# EAGLE board coke (EAGLE 5.06)
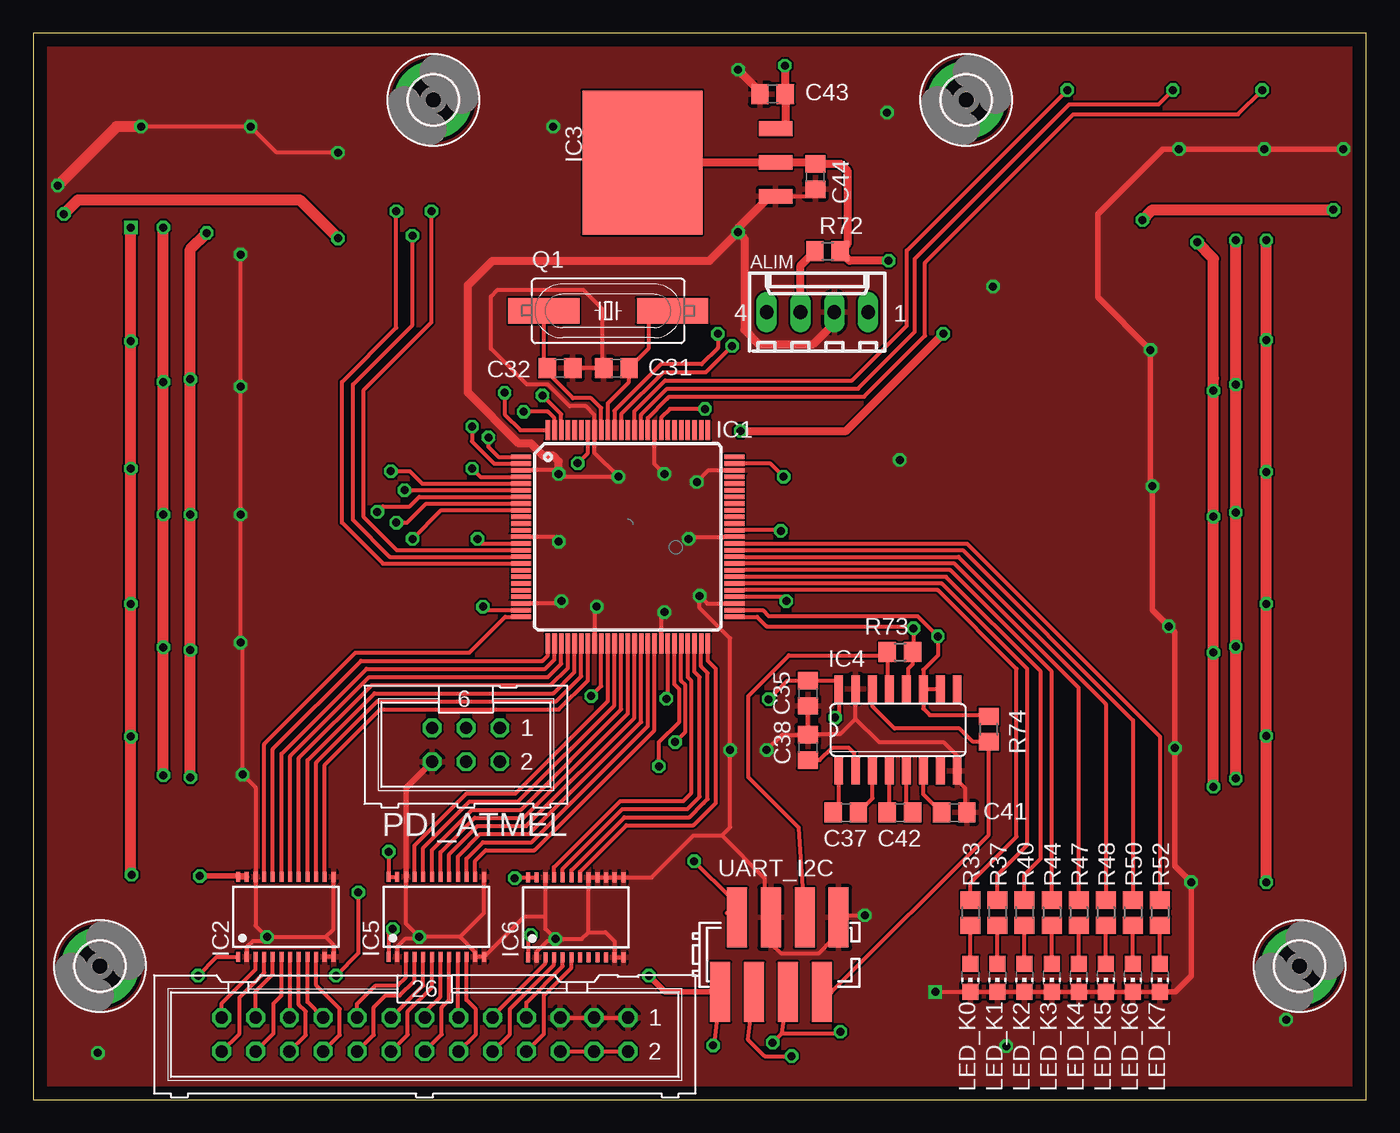
[diagram p2: board, top side]
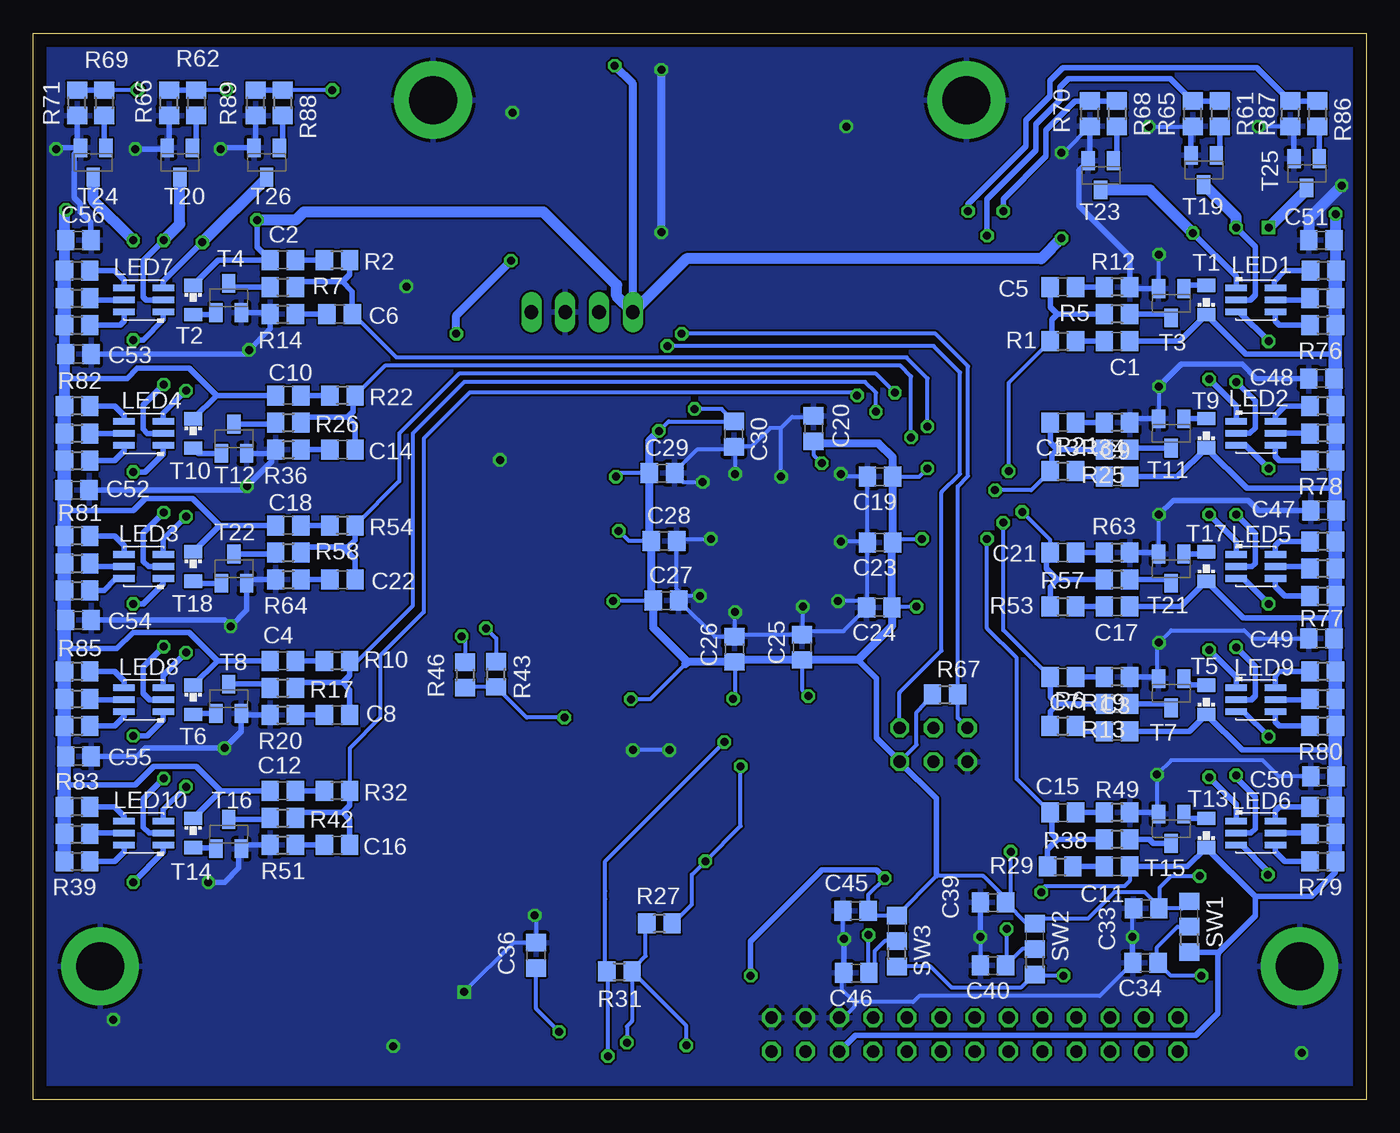
[diagram p3: board, bottom side, seen from below]

Size 100 x 80 mm. Coordinates in mm from the lower left corner, seen from the top.
Outline: 0,0 100,0 100,80 0,80 0,0
Copper layers (1*16): Top 0.035mm / dielectric 1.5mm / Bottom 0.035mm
Design rules "default *": minimum track width 6mil, minimum drill 0.3mm, track to track 6mil, track to pad 6mil, pad to pad 6mil, via to via 6mil, smd to smd 6mil, copper to edge 40mil, drill to drill 8mil, minimum pad ring 10mil, minimum via ring 8mil, stop-mask expansion 4mil, vias tented up to drill 0mil, thermal gap 10mil

## Footprints (pad centres in the part's own frame; a part is rotated, then mirrored left to right if it is on the bottom)
6410-04 = drill 1.016 long: 1 3.81,0; 2 1.27,0; 3 -1.27,0; 4 -3.81,0
C0805 = smd 1.3 x 1.5: 1 -0.95,0; 2 0.95,0
3,6-PAD = drill 3.6 pad 5.842 round: B3,6 0,0
TQFP100 = smd 1.5 x 0.347: 1 -8,6; 2 -8,5.5; 3 -8,5; 4 -8,4.5; 5 -8,4; 6 -8,3.5; 7 -8,3; 8 -8,2.5; 9 -8,2; 10 -8,1.5; 11 -8,1; 12 -8,0.5; 13 -8,0; 14 -8,-0.5; 15 -8,-1; 16 -8,-1.5; 17 -8,-2; 18 -8,-2.5; 19 -8,-3; 20 -8,-3.5; 21 -8,-4; 22 -8,-4.5; 23 -8,-5; 24 -8,-5.5; 25 -8,-6; 51 8,-6; 52 8,-5.5; 53 8,-5; 54 8,-4.5; 55 8,-4; 56 8,-3.5; 57 8,-3; 58 8,-2.5; 59 8,-2; 60 8,-1.5; 61 8,-1; 62 8,-0.5; 63 8,0; 64 8,0.5; 65 8,1; 66 8,1.5; 67 8,2; 68 8,2.5; 69 8,3; 70 8,3.5; 71 8,4; 72 8,4.5; 73 8,5; 74 8,5.5; 75 8,6 | smd 0.347 x 1.5: 26 -6,-8; 27 -5.5,-8; 28 -5,-8; 29 -4.5,-8; 30 -4,-8; 31 -3.5,-8; 32 -3,-8; 33 -2.5,-8; 34 -2,-8; 35 -1.5,-8; 36 -1,-8; 37 -0.5,-8; 38 0,-8; 39 0.5,-8; 40 1,-8; 41 1.5,-8; 42 2,-8; 43 2.5,-8; 44 3,-8; 45 3.5,-8; 46 4,-8; 47 4.5,-8; 48 5,-8; 49 5.5,-8; 50 6,-8; 76 6,8; 77 5.5,8; 78 5,8; 79 4.5,8; 80 4,8; 81 3.5,8; 82 3,8; 83 2.5,8; 84 2,8; 85 1.5,8; 86 1,8; 87 0.5,8; 88 0,8; 89 -0.5,8; 90 -1,8; 91 -1.5,8; 92 -2,8; 93 -2.5,8; 94 -3,8; 95 -3.5,8; 96 -4,8; 97 -4.5,8; 98 -5,8; 99 -5.5,8; 100 -6,8
TSSOP24 = smd 0.3 x 0.75: 1 -3.575,-3; 2 -2.925,-3; 3 -2.275,-3; 4 -1.625,-3; 5 -0.975,-3; 6 -0.325,-3; 7 0.325,-3; 8 0.975,-3; 9 1.625,-3; 10 2.275,-3; 11 2.925,-3; 12 3.575,-3; 13 3.575,3; 14 2.925,3; 15 2.275,3; 16 1.625,3; 17 0.975,3; 18 0.325,3; 19 -0.325,3; 20 -0.975,3; 21 -1.625,3; 22 -2.275,3; 23 -2.925,3; 24 -3.575,3
TO263 = smd 1.1 x 2.5: 1 -2.54,-8.15; 2 0,-8.15; 3 2.54,-8.15 | smd 10.8 x 9: 4 0,1.85
SO16 = smd 0.66 x 2.032: 1 -4.445,-3.073; 2 -3.175,-3.073; 3 -1.905,-3.073; 4 -0.635,-3.073; 5 0.635,-3.073; 6 1.905,-3.073; 7 3.175,-3.073; 8 4.445,-3.073; 9 4.445,3.073; 10 3.175,3.073; 11 1.905,3.073; 12 0.635,3.073; 13 -0.635,3.073; 14 -1.905,3.073; 15 -3.175,3.073; 16 -4.445,3.073
PLCC6 = smd 1.6 x 0.5: 1 1.475,-0.9; 2 1.475,0; 3 1.475,0.9; 4 -1.475,0.9; 5 -1.475,0; 6 -1.475,-0.9
CHIP-LED0805 = smd 1.2 x 1.2: A 0,-1.05; C 0,1.05
ML6 = drill 0.914 octagon: 1 -2.54,-1.27; 2 -2.54,1.27; 3 0,-1.27; 4 0,1.27; 5 2.54,-1.27; 6 2.54,1.27
HC49UP = smd 5.334 x 1.93: 1 -4.826,0; 2 4.826,0
R0805 = smd 1.3 x 1.5: 1 -0.95,0; 2 0.95,0
ML26 = drill 0.914 octagon: 1 -15.24,-1.27; 2 -15.24,1.27; 3 -12.7,-1.27; 4 -12.7,1.27; 5 -10.16,-1.27; 6 -10.16,1.27; 7 -7.62,-1.27; 8 -7.62,1.27; 9 -5.08,-1.27; 10 -5.08,1.27; 11 -2.54,-1.27; 12 -2.54,1.27; 13 0,-1.27; 14 0,1.27; 15 2.54,-1.27; 16 2.54,1.27; 17 5.08,-1.27; 18 5.08,1.27; 19 7.62,-1.27; 20 7.62,1.27; 21 10.16,-1.27; 22 10.16,1.27; 23 12.7,-1.27; 24 12.7,1.27; 25 15.24,-1.27; 26 15.24,1.27
SWITCH_0805 = smd 1.3 x 1.5: 1 0.01,0; 2 1.91,0; 3 -1.9,0
SFH3710 = smd 1 x 1.35: C 1.1,0; E -1.1,0
SOT23-BEC = smd 1 x 1.4: B -0.95,-1.1; C 0,1.1; E 0.95,-1.1
MICROMATCH-8_SMD = smd 1.5 x 4.5: 1 4.445,2.794; 2 3.175,-2.794; 3 1.905,2.794; 4 0.635,-2.794; 5 -0.635,2.794; 6 -1.905,-2.794; 7 -3.175,2.794; 8 -4.445,-2.794

## Placement (x,y rotation side)
ALIM  22-27-2041-04  [6410-04]  58.83,59.08 0 top
C1  C_100NF_50V_0805  [C0805]  18.69,56.9 0 bottom
C2  C_100NF_50V_0805  [C0805]  81.28,62.99 180 bottom
C3  C_100NF_50V_0805  [C0805]  18.69,27.64 0 bottom
C4  C_100NF_50V_0805  [C0805]  81.28,32.92 180 bottom
C5  C_100NF_50V_0805  [C0805]  22.76,60.96 180 bottom
C6  C_100NF_50V_0805  [C0805]  77.01,58.93 0 bottom
C7  C_100NF_50V_0805  [C0805]  22.76,31.7 180 bottom
C8  C_100NF_50V_0805  [C0805]  77.22,28.85 0 bottom
C9  C_100NF_50V_0805  [C0805]  18.69,46.74 0 bottom
C10  C_100NF_50V_0805  [C0805]  80.87,52.83 180 bottom
C11  C_100NF_50V_0805  [C0805]  18.69,17.48 0 bottom
C12  C_100NF_50V_0805  [C0805]  81.28,23.16 180 bottom
C13  C_100NF_50V_0805  [C0805]  22.76,50.8 180 bottom
C14  C_100NF_50V_0805  [C0805]  76.81,48.77 0 bottom
C15  C_100NF_50V_0805  [C0805]  22.76,21.54 180 bottom
C16  C_100NF_50V_0805  [C0805]  77.22,19.1 0 bottom
C17  C_100NF_50V_0805  [C0805]  18.69,36.98 0 bottom
C18  C_100NF_50V_0805  [C0805]  80.87,43.08 180 bottom
C19  C_100NF_50V_0805  [C0805]  36.47,46.74 180 bottom
C20  C_100NF_50V_0805  [C0805]  41.45,50.34 90 bottom
C21  C_100NF_50V_0805  [C0805]  22.76,41.05 180 bottom
C22  C_100NF_50V_0805  [C0805]  76.81,39.01 0 bottom
C23  C_100NF_50V_0805  [C0805]  36.47,41.81 180 bottom
C24  C_100NF_50V_0805  [C0805]  36.53,36.93 180 bottom
C25  C_100NF_50V_0805  [C0805]  42.32,33.93 90 bottom
C26  C_100NF_50V_0805  [C0805]  47.4,33.78 90 bottom
C27  C_100NF_50V_0805  [C0805]  52.53,37.44 0 bottom
C28  C_100NF_50V_0805  [C0805]  52.68,41.91 0 bottom
C29  C_100NF_50V_0805  [C0805]  52.83,46.99 0 bottom
C30  C_100NF_50V_0805  [C0805]  47.45,49.94 270 bottom
C31  C_15PF_100V_0805  [C0805]  43.74,54.86 0 top
C32  C_15PF_100V_0805  [C0805]  39.52,54.86 180 top
C33  C_100NF_50V_0805  [C0805]  16.51,14.33 180 bottom
C34  C_100NF_50V_0805  [C0805]  16.56,10.26 180 bottom
C35  C_100NF_50V_0805  [C0805]  58.12,30.48 270 top
C36  C_100NF_50V_0805  [C0805]  62.28,10.82 90 bottom
C37  C_100NF_50V_0805  [C0805]  60.96,21.54 0 top
C38  C_100NF_50V_0805  [C0805]  58.12,26.42 90 top
C39  C_100NF_50V_0805  [C0805]  27.99,14.78 180 bottom
C40  C_100NF_50V_0805  [C0805]  27.99,10.06 180 bottom
C41  C_100NF_50V_0805  [C0805]  69.09,21.54 0 top
C42  C_100NF_50V_0805  [C0805]  65.02,21.54 0 top
C43  C_100NF_50V_0805  [C0805]  55.47,75.44 180 top
C44  C_100NF_50V_0805  [C0805]  58.67,69.24 270 top
C45  C_100NF_50V_0805  [C0805]  38.3,14.17 180 bottom
C46  C_100NF_50V_0805  [C0805]  38.25,9.5 180 bottom
C47  C_100NF_50V_0805  [C0805]  3.2,44.2 180 bottom
C48  C_100NF_50V_0805  [C0805]  3.35,54.1 180 bottom
C49  C_100NF_50V_0805  [C0805]  3.35,34.59 180 bottom
C50  C_100NF_50V_0805  [C0805]  3.2,24.23 180 bottom
C51  C_100NF_50V_0805  [C0805]  3.35,64.47 180 bottom
C52  C_100NF_50V_0805  [C0805]  96.77,45.72 0 bottom
C53  C_100NF_50V_0805  [C0805]  96.62,55.93 0 bottom
C54  C_100NF_50V_0805  [C0805]  96.62,35.97 0 bottom
C55  C_100NF_50V_0805  [C0805]  96.62,25.76 0 bottom
C56  C_100NF_50V_0805  [C0805]  96.62,64.47 0 bottom
H1  MOUNT-PAD-ROUND3.6  [3,6-PAD]  95,10 0 top
H2  MOUNT-PAD-ROUND3.6  [3,6-PAD]  5,10 0 top
H3  MOUNT-PAD-ROUND3.6  [3,6-PAD]  30,75 0 top
H4  MOUNT-PAD-ROUND3.6  [3,6-PAD]  70,75 0 top
IC1  XMEGA128-A1  [TQFP100]  44.6,42.21 0 top
IC2  74LVC4245A  [TSSOP24]  18.95,13.72 0 top
IC3  LM1086CS-3.3  [TO263]  47.55,70.31 90 top
IC4  MAX3232CSE  [SO16]  64.87,27.74 0 top
IC5  74LVC4245A  [TSSOP24]  30.23,13.72 0 top
IC6  74LVC4245A  [TSSOP24]  40.69,13.67 0 top
LED1  LED_MULTICOLOR  [PLCC6]  8.28,60 180 bottom
LED2  LED_MULTICOLOR  [PLCC6]  8.28,50 180 bottom
LED3  LED_MULTICOLOR  [PLCC6]  91.72,40 0 bottom
LED4  LED_MULTICOLOR  [PLCC6]  91.72,49.99 0 bottom
LED5  LED_MULTICOLOR  [PLCC6]  8.28,40 180 bottom
LED6  LED_MULTICOLOR  [PLCC6]  8.28,20 180 bottom
LED7  LED_MULTICOLOR  [PLCC6]  91.72,60 0 bottom
LED8  LED_MULTICOLOR  [PLCC6]  91.72,30 0 bottom
LED9  LED_MULTICOLOR  [PLCC6]  8.28,30 180 bottom
LED10  LED_MULTICOLOR  [PLCC6]  91.72,20 0 bottom
LED_K0  LED_GREEN_0805  [CHIP-LED0805]  70.31,9.14 180 top
LED_K1  LED_GREEN_0805  [CHIP-LED0805]  72.34,9.14 180 top
LED_K2  LED_GREEN_0805  [CHIP-LED0805]  74.37,9.14 180 top
LED_K3  LED_GREEN_0805  [CHIP-LED0805]  76.4,9.14 180 top
LED_K4  LED_GREEN_0805  [CHIP-LED0805]  78.44,9.14 180 top
LED_K5  LED_GREEN_0805  [CHIP-LED0805]  80.47,9.14 180 top
LED_K6  LED_GREEN_0805  [CHIP-LED0805]  82.5,9.14 180 top
LED_K7  LED_GREEN_0805  [CHIP-LED0805]  84.53,9.14 180 top
PDI_ATMEL  [ML6]  32.46,26.62 180 top
Q1  [HC49UP]  43.13,59.18 0 top
R1  RES_1K_5P_0805  [R0805]  22.76,56.9 0 bottom
R2  RES_1K_5P_0805  [R0805]  77.22,62.99 180 bottom
R3  RES_270_5P_0805  [R0805]  3.22,62.18 180 bottom
R4  RES_270_5P_0805  [R0805]  96.72,58.12 0 bottom
R5  RES_15K_5P_0805  [R0805]  18.69,58.93 180 bottom
R6  RES_1K_5P_0805  [R0805]  22.76,28.04 0 bottom
R7  RES_15K_5P_0805  [R0805]  81.28,60.96 0 bottom
R8  RES_270_5P_0805  [R0805]  3.25,60.15 180 bottom
R9  RES_270_5P_0805  [R0805]  96.72,60.15 0 bottom
R10  RES_1K_5P_0805  [R0805]  77.22,32.92 180 bottom
R11  RES_270_5P_0805  [R0805]  3.25,32.11 180 bottom
R12  RES_1K_5P_0805  [R0805]  18.69,60.96 180 bottom
R13  RES_15K_5P_0805  [R0805]  18.69,29.67 180 bottom
R14  RES_1K_5P_0805  [R0805]  81.28,58.93 0 bottom
R15  RES_270_5P_0805  [R0805]  96.72,28.04 0 bottom
R16  RES_270_5P_0805  [R0805]  3.25,30.07 180 bottom
R17  RES_15K_5P_0805  [R0805]  81.28,30.89 0 bottom
R18  RES_270_5P_0805  [R0805]  96.72,30.07 0 bottom
R19  RES_1K_5P_0805  [R0805]  18.69,31.7 180 bottom
R20  RES_1K_5P_0805  [R0805]  81.28,28.85 0 bottom
R21  RES_1K_5P_0805  [R0805]  22.76,47.14 0 bottom
R22  RES_1K_5P_0805  [R0805]  76.81,52.83 180 bottom
R23  RES_270_5P_0805  [R0805]  3.25,52.02 180 bottom
R24  RES_270_5P_0805  [R0805]  96.72,47.96 0 bottom
R25  RES_15K_5P_0805  [R0805]  18.69,48.77 180 bottom
R26  RES_15K_5P_0805  [R0805]  80.87,50.8 0 bottom
R27  RES_2K2_5P_0805  [R0805]  53.04,13.21 180 bottom
R28  RES_270_5P_0805  [R0805]  3.25,49.99 180 bottom
R29  RES_1K_5P_0805  [R0805]  22.96,17.48 0 bottom
R30  RES_270_5P_0805  [R0805]  96.72,49.99 0 bottom
R31  RES_2K2_5P_0805  [R0805]  56.03,9.6 0 bottom
R32  RES_1K_5P_0805  [R0805]  77.22,23.16 180 bottom
R33  RES_270_5P_0805  [R0805]  70.31,14.02 270 top
R34  RES_1K_5P_0805  [R0805]  18.69,50.8 180 bottom
R35  RES_270_5P_0805  [R0805]  3.25,21.95 180 bottom
R36  RES_1K_5P_0805  [R0805]  80.87,48.77 0 bottom
R37  RES_270_5P_0805  [R0805]  72.34,14.02 270 top
R38  RES_15K_5P_0805  [R0805]  18.69,19.51 180 bottom
R39  RES_270_5P_0805  [R0805]  96.72,17.88 0 bottom
R40  RES_270_5P_0805  [R0805]  74.37,14.02 270 top
R41  RES_270_5P_0805  [R0805]  3.25,19.91 180 bottom
R42  RES_15K_5P_0805  [R0805]  81.28,21.13 0 bottom
R43  RES_10K_5P_0805  [R0805]  65.28,31.9 90 bottom
R44  RES_270_5P_0805  [R0805]  76.4,14.02 270 top
R45  RES_270_5P_0805  [R0805]  96.72,19.91 0 bottom
R46  RES_10K_5P_0805  [R0805]  67.61,31.85 270 bottom
R47  RES_270_5P_0805  [R0805]  78.44,14.02 270 top
R48  RES_270_5P_0805  [R0805]  80.47,14.02 270 top
R49  RES_1K_5P_0805  [R0805]  18.69,21.54 180 bottom
R50  RES_270_5P_0805  [R0805]  82.5,14.02 270 top
R51  RES_1K_5P_0805  [R0805]  81.28,19.1 0 bottom
R52  RES_270_5P_0805  [R0805]  84.53,14.02 270 top
R53  RES_1K_5P_0805  [R0805]  22.76,36.98 0 bottom
R54  RES_1K_5P_0805  [R0805]  76.81,43.08 180 bottom
R55  RES_270_5P_0805  [R0805]  3.25,41.86 180 bottom
R56  RES_270_5P_0805  [R0805]  96.72,38.2 0 bottom
R57  RES_15K_5P_0805  [R0805]  18.69,39.01 180 bottom
R58  RES_15K_5P_0805  [R0805]  80.87,41.05 0 bottom
R59  RES_270_5P_0805  [R0805]  3.25,39.83 180 bottom
R60  RES_270_5P_0805  [R0805]  96.72,40.23 0 bottom
R61  RES_1K_5P_0805  [R0805]  10.97,73.96 270 bottom
R62  RES_1K_5P_0805  [R0805]  87.78,74.78 270 bottom
R63  RES_1K_5P_0805  [R0805]  18.69,41.05 180 bottom
R64  RES_1K_5P_0805  [R0805]  80.87,39.01 0 bottom
R65  RES_10K_5P_0805  [R0805]  13,73.96 90 bottom
R66  RES_10K_5P_0805  [R0805]  89.81,74.78 90 bottom
R67  RES_10K_5P_0805  [R0805]  31.6,30.38 0 bottom
R68  RES_1K_5P_0805  [R0805]  18.69,73.96 270 bottom
R69  RES_1K_5P_0805  [R0805]  94.69,74.78 270 bottom
R70  RES_10K_5P_0805  [R0805]  20.73,73.96 90 bottom
R71  RES_10K_5P_0805  [R0805]  96.72,74.78 90 bottom
R72  RES_0_5P_0805  [R0805]  59.59,63.65 0 top
R73  RES_0_5P_0805  [R0805]  65.02,33.58 0 top
R74  RES_0_5P_0805  [R0805]  71.68,27.79 90 top
R76  RES_470_5P_0805  [R0805]  3.25,58.12 0 bottom
R77  RES_270_5P_0805  [R0805]  3.25,37.8 0 bottom
R78  RES_270_5P_0805  [R0805]  3.25,47.96 0 bottom
R79  RES_270_5P_0805  [R0805]  3.25,17.88 0 bottom
R80  RES_270_5P_0805  [R0805]  3.25,28.04 0 bottom
R81  RES_270_5P_0805  [R0805]  96.72,42.27 180 bottom
R82  RES_270_5P_0805  [R0805]  96.72,52.02 180 bottom
R83  RES_270_5P_0805  [R0805]  96.72,21.95 180 bottom
R84  RES_270_5P_0805  [R0805]  96.72,62.18 180 bottom
R85  RES_270_5P_0805  [R0805]  96.72,32.11 180 bottom
R86  RES_1K_5P_0805  [R0805]  3.66,73.96 270 bottom
R87  RES_10K_5P_0805  [R0805]  5.69,73.96 90 bottom
R88  RES_1K_5P_0805  [R0805]  81.28,74.78 270 bottom
R89  RES_10K_5P_0805  [R0805]  83.31,74.78 90 bottom
SENSOR_STATUS  [ML26]  29.37,4.88 180 top
SW1  SWITCH_0805  [SWITCH_0805]  13.26,12.95 90 bottom
SW2  SWITCH_0805  [SWITCH_0805]  24.84,11.28 90 bottom
SW3  SWITCH_0805  [SWITCH_0805]  35.2,11.89 90 bottom
T1  SFH3710  [SFH3710]  11.99,60 270 bottom
T2  SFH3710  [SFH3710]  88.01,60 90 bottom
T3  MMBT2222LT1G  [SOT23-BEC]  14.63,59.74 180 bottom
T4  MMBT2222LT1G  [SOT23-BEC]  85.34,60.15 0 bottom
T5  SFH3710  [SFH3710]  11.99,30 270 bottom
T6  SFH3710  [SFH3710]  88.01,30 90 bottom
T7  MMBT2222LT1G  [SOT23-BEC]  14.63,30.48 180 bottom
T8  MMBT2222LT1G  [SOT23-BEC]  85.34,30.07 0 bottom
T9  SFH3710  [SFH3710]  11.99,50 270 bottom
T10  SFH3710  [SFH3710]  88.01,49.99 90 bottom
T11  MMBT2222LT1G  [SOT23-BEC]  14.63,49.99 180 bottom
T12  MMBT2222LT1G  [SOT23-BEC]  84.94,49.58 0 bottom
T13  SFH3710  [SFH3710]  11.99,20 270 bottom
T14  SFH3710  [SFH3710]  88.01,20 90 bottom
T15  MMBT2222LT1G  [SOT23-BEC]  14.63,20.32 180 bottom
T16  MMBT2222LT1G  [SOT23-BEC]  85.34,19.91 0 bottom
T17  SFH3710  [SFH3710]  11.99,40 270 bottom
T18  SFH3710  [SFH3710]  88.01,40 90 bottom
T19  MMBT2222LT1G  [SOT23-BEC]  12.19,69.75 180 bottom
T20  MMBT2222LT1G  [SOT23-BEC]  89,70.31 180 bottom
T21  MMBT2222LT1G  [SOT23-BEC]  14.63,39.83 180 bottom
T22  MMBT2222LT1G  [SOT23-BEC]  84.94,39.83 0 bottom
T23  MMBT2222LT1G  [SOT23-BEC]  19.91,69.34 180 bottom
T24  MMBT2222LT1G  [SOT23-BEC]  95.5,70.31 180 bottom
T25  MMBT2222LT1G  [SOT23-BEC]  4.47,69.49 180 bottom
T26  MMBT2222LT1G  [SOT23-BEC]  82.5,70.31 180 bottom
UART_I2C  MICROMATCH-8_SMD  [MICROMATCH-8_SMD]  55.98,10.87 0 top

## Tracks (layer width: path | path; a pad name or v marks a point on that pad's centre or on a via)
3V3_BUS
  Top 0.61: ALIM.3 57.56,62.57 R72.1
+3V3  (via drill 0.6)
  Top 0.305: v60.15,28.65 60.43,28.93 IC4.16 60.35,30.89 60.35,31.5 60.28,31.43 C35.1 56.58,31.43 v55.17,30.02 | 56.16,4.95 UART_I2C.4 | v55.47,4.27 56.16,4.95 | v51,4.06 51.08,4.14 UART_I2C.8 | C44.1 55.82,70.19 IC3.2 | v41.86,30.28 42.6,31.02 IC1.34 | v47.5,30.07 47.6,30.33 IC1.44 | IC1.24 34,36.72 v33.73,36.98 | IC1.14 33.67,41.72 v33.33,42.06 | IC1.4 33.55,46.72 v32.92,47.35 | v40.84,47.75 41.6,48.51 IC1.94 | 56.16,4.95 60.43,4.95 v60.55,5.08 | IC1.54 56.16,37.72 v56.49,37.39 | v56.08,42.67 56.04,42.72 IC1.64 | v56.29,46.74 55.31,47.72 IC1.74 | IC1.83 47.1,51.17 47.75,51.82 v50.39,51.82 | 37.77,16.58 IC6.23 IC6.24 36.17,16.66 v36.12,16.61 | v26.67,18.59 26.65,18.59 IC5.24 IC5.23
  Top 0.406: UART_I2C.8 47.4,8.08 v46.18,9.3 | IC2.24 IC2.23 15.97,16.76 v12.5,16.76
  Top 0.61: IC3.4 58.56,70.31 C44.1 60.57,70.19 61.11,69.65 61.11,64.23 R72.2 61.25,62.94 v64.16,62.94 | v68.28,57.45 60.98,50.16 v53.06,50.16
  Bottom 0.305: R46.2 67.56,30.95 R43.1 62.98,28.65 v60.15,28.65 | R67.1 33.53,29.26 33.73,29.06 33.73,26.62 PDI_ATMEL.2 | R31.2 54.8,9.89 54.8,10.02 54.05,10.77 54.05,13.14 R27.2 | R31.2 55.08,5.88 55.47,5.49 v55.47,4.27 | R31.2 51,5.52 v51,4.06 | C26.1 47.35,32.78 47.35,30.23 v47.5,30.07 | v33.73,36.98 35.52,36.98 C24.1 35.56,36.92 | v33.33,42.06 35.27,42.06 C23.1 35.58,41.76 | v40.84,47.75 41.45,48.36 C20.1 41.44,49.38 | C25.1 42.32,30.73 v41.86,30.28 | C36.1 62.28,6.81 v60.55,5.08 | 56.44,37.44 v56.49,37.39 53.53,37.39 C27.1 | v56.08,42.67 55.32,41.91 C28.1 | C29.1 56.03,46.99 v56.29,46.74 | v53.06,50.16 52.34,50.89 C30.1 47.97,51.41 47.95,51.41 48.36,51.82 v50.39,51.82 | C29.1 53.65,47.13 | C29.1 53.63,46.84 | C33.1 15.39,14 | C33.1 15.49,14.86 15.49,15.91 14.63,16.76 v12.5,16.76 | C39.1 27.3,15.04 27.3,15.34 28.72,16.76 32.24,16.76 SW3.2 36.98,13.8 C45.1 37.35,15.38 v36.12,16.61 | v55.17,30.02 53.73,30.02 51.09,32.65 | C19.1 33.53,46.74 v32.92,47.35 | C33.1 15.39,14.04 | C33.1 16,14.31 16,14.94 16.61,15.54 18.9,15.54 20.88,13.56 24.3,13.56 SW2.2 25.45,13.19 C39.1 | SW1.2 13.8,14.33 C33.1 | v26.67,18.59 26.67,14.78 C39.1
  Bottom 0.406: 32.24,16.76 32.24,22.59 PDI_ATMEL.2 35,25.4 36.73,27.13 36.73,31.58 38.14,32.98 | v46.18,9.3 46.18,11.89 40.84,17.22 36.73,17.22 v36.12,16.61
  Bottom 0.61: v64.16,62.94 68.28,58.83 v68.28,57.45 | C23.1 C19.1 35.52,48.17 36.58,49.23 41.28,49.23 C20.1 | C24.1 35.58,41.76 | 35.56,36.92 35.56,35.56 38.14,32.98 C25.1 47.24,32.98 C26.1 50.92,32.83 | 50.92,32.83 51.09,32.65 | 50.92,32.83 53.48,35.39 C27.1 53.63,37.59 C28.1 53.78,42.06 C29.1 53.78,49.44 v53.06,50.16
+5V  (via drill 0.6)
  Top 0.305: 56.42,72.85 IC3.3 | v24.38,15.54 24.38,10.97 v22.71,9.3 | SENSOR_STATUS.2 SENSOR_STATUS.4 SENSOR_STATUS.6
  Top 0.61: v56.39,77.57 56.39,75.47 C43.1 56.42,72.85
  Top 0.813: v22.86,64.62 19.96,67.51 3.35,67.51 v2.29,66.45 | v83.21,65.99 83.97,66.75 v97.54,66.75
  Bottom 0.305: C11.2 17.74,16.39 18.14,16 24.08,16 24.38,15.7 v24.38,15.54 | SW3.3 32.7,9.99 31.09,8.38 25.91,8.38 24.91,9.38 SW2.3 24.76,9.3 v22.71,9.3 | C49.1 2.4,35.71 2.3,35.81 | 11.04,11.05 11.04,10.89 11.12,10.82
  Bottom 0.406: T2.C 86.11,62.99 C2.2 83.21,63.97 v83.21,65.99 | 86.26,52.83 T10.C | 86.26,52.83 C10.2 | 86.03,43.08 C18.2 | 86.03,43.08 T18.C | 86.19,32.92 C4.2 | 86.19,32.92 T6.C | 85.94,23.16 T14.C | 85.94,23.16 C12.2 | C11.2 13.42,17.48 T13.C 8.34,15.24 | C3.2 13.26,27.64 T5.C 9.31,26.21 2.3,26.21 | C17.2 13.91,36.98 T17.C 9.21,36.12 2.3,36.12 | C9.2 14.16,46.74 T9.C 8.97,45.87 2.3,45.87 | C1.2 14,56.9 T1.C | T1.C 11.96,58.9 | 8.34,15.24 4.12,15.24 2.3,17.05 R79.2 | 86.03,43.08 88.06,45.11 91.59,45.11 92.51,44.2 97.52,44.2 97.67,44.04 | 8.34,15.24 8.34,13.76 11.04,11.05 SW1.3 | 85.94,23.16 87.77,24.99 90.98,24.99 92.35,23.62 97.67,23.62 | 2.3,55.93 9.03,55.93 T1.C | 97.67,54.1 92.96,54.1 92.2,54.86 88.29,54.86 86.26,52.83 | C52.1 97.72,45.31 97.67,45.26 | 97.67,55.32 97.67,55.18 97.69,55.17 97.69,55.81 C53.1 | C54.1 97.57,35.61 97.67,35.51 | C55.1 97.57,25.7 97.67,25.6 | 86.19,32.92 88.32,35.05 92.51,35.05 93.73,33.83 97.67,33.83 | 97.67,66.61 97.67,66.74 97.69,66.75 97.69,64.58 C56.1 | C48.1 2.4,54.61 2.3,54.71 | C47.1 2.25,44.6 2.3,44.65 | 11.12,10.82 11.12,6.46 12.77,4.81 38.33,4.81 SENSOR_STATUS.6
  Bottom 0.61: ALIM.4 55.02,76.2 v56.39,77.57
  Bottom 0.813: R82.2 97.67,54.1 97.67,55.32 R4.1 | v22.86,64.62 24.38,63.09 51,63.09 ALIM.4 56.24,60.3 56.24,61.11 61.72,66.6 79.7,66.6 80.31,65.99 v83.21,65.99 | R3.1 2.27,64.76 2.4,64.63 C51.1 2.29,64.58 v2.29,66.45 | v97.54,66.75 97.67,66.61 R84.2 | C50.1 2.3,24.28 2.3,24.84
  Bottom 1.016: R79.2 R41.1 R35.1 2.3,24.84 2.3,26.21 R80.2 R16.1 R11.1 2.3,35.81 2.3,36.12 R77.2 R59.1 R55.1 2.3,44.65 2.3,45.87 R78.2 R28.1 R23.1 2.3,54.71 2.3,55.93 R76.2 R8.1 2.3,62.15 R3.1 | R84.2 R9.1 R4.1 | R82.2 R30.1 R24.1 97.67,45.26 97.67,44.04 R81.2 R60.1 R56.1 97.67,35.51 97.67,33.83 R85.2 R18.1 R15.1 97.67,25.6 97.67,23.62 R83.2 R45.1 R39.1
/RESET_3V3  (via drill 0.6)
  Top 0.305: IC1.90 43.6,51.68 47.09,55.17 50.14,55.17 51.36,56.39 v51.36,57.45
  Bottom 0.305: PDI_ATMEL.5 30.65,28.62 R67.2 30.65,46.01 29.87,46.79 29.87,55.02 32.31,57.45 v51.36,57.45
BLUE_FRONT_0_5V
  Top 0.305: IC2.3 16.67,9.76 14.13,7.22 SENSOR_STATUS.25
BLUE_FRONT_1_5V
  Top 0.305: IC2.4 17.32,9.51 15.47,7.66 15.47,4.95 SENSOR_STATUS.26
BLUE_FRONT_2_5V
  Top 0.305: IC2.5 17.97,9.41 17.05,8.49 16.67,8.11 SENSOR_STATUS.23
BLUE_FRONT_3_5V
  Top 0.305: IC2.6 18.62,7.81 18.03,7.21 18.03,4.96 SENSOR_STATUS.24
BLUE_FRONT_4_5V
  Top 0.305: IC2.7 19.27,6.21 SENSOR_STATUS.21
BLUE_LED_ON_FRONT_3V3  (via drill 0.6)
  Top 0.305: IC1.17 26.23,40.22 23.16,43.28 23.16,53.85 27.23,57.91 v27.23,66.66
  Bottom 0.406: R68.1 R70.2 21.87,74.92 24.04,72.75 24.04,70.76 27.23,67.57 v27.23,66.66
BLUE_LED_ON_FRONT_PW  (via drill 0.6)
  Top 0.813: v13.01,65.02 11.79,63.8 v11.79,54.05 v11.79,43.89 v11.79,33.73 v11.79,24.18
  Bottom 0.406: LED9.1 9.76,31.7 v11.79,33.73 | LED6.1 9.76,22.15 v11.79,24.18 | LED5.1 9.76,41.86 v11.79,43.89 | LED2.1 9.76,52.02 v11.79,54.05 | LED1.1 9.76,61.78 v13.01,65.02
  Bottom 0.813: T23.C 16.22,68.24 v13.01,65.02
BLUE_LED_ON_REAR_3V3  (via drill 0.6)
  Top 0.305: v92.2,75.74 90.37,73.91 78.03,73.91 66.9,62.79 66.9,57.3 62.33,52.73 47.7,52.73 47.55,52.58 46.1,51.13 IC1.85
  Bottom 0.305: v92.2,75.74 94.68,75.74 R69.1
  Bottom 0.406: R69.1 R71.2
BLUE_LED_ON_REAR_PW  (via drill 0.6)
  Top 0.813: v92.51,16.31 v92.51,27.28 v92.51,37.19 v92.51,47.09 v92.51,57 v92.51,64.47
  Bottom 0.406: LED4.1 90.24,48.44 91.59,47.09 v92.51,47.09 | LED7.1 90.24,58.5 91.75,57 v92.51,57 | LED3.1 90.24,38.69 91.75,37.19 v92.51,37.19 | LED8.1 90.24,28.48 91.44,27.28 v92.51,27.28 | LED10.1 90.24,18.57 v92.51,16.31
  Bottom 0.813: T24.C 95.5,67.46 v92.51,64.47
BLUE_REAR_0_5V
  Top 0.305: IC5.5 29.25,8.57 SENSOR_STATUS.15
BLUE_REAR_1_5V
  Top 0.305: SENSOR_STATUS.16 28.09,4.87 28.09,6.61 29.9,8.42 IC5.6
BLUE_REAR_2_5V
  Top 0.305: IC5.7 30.55,7.71 29.37,6.54 SENSOR_STATUS.13
BLUE_REAR_3_5V
  Top 0.305: IC5.8 31.2,7.46 30.65,6.91 30.65,4.88 SENSOR_STATUS.14
BLUE_REAR_4_5V
  Top 0.305: IC5.9 31.85,6.21 SENSOR_STATUS.11
BLUE_SENSOR_FRONT_STATE_0_3V3
  Top 0.305: IC1.25 35.4,36.22 32.72,33.53 24.18,33.53 17.32,26.67 IC2.21
BLUE_SENSOR_FRONT_STATE_1_3V3
  Top 0.305: IC1.26 38.6,33.32 38.2,32.92 24.59,32.92 17.97,26.3 IC2.20
BLUE_SENSOR_FRONT_STATE_2_3V3
  Top 0.305: IC1.27 39.1,33.01 38.41,32.31 24.99,32.31 18.62,25.94 IC2.19
BLUE_SENSOR_FRONT_STATE_3_3V3
  Top 0.305: IC1.28 39.6,32.69 38.61,31.7 25.2,31.7 19.27,25.78 IC2.18
BLUE_SENSOR_FRONT_STATE_4_3V3
  Top 0.305: IC1.29 40.1,32.38 38.81,31.09 25.4,31.09 19.92,25.61 IC2.17
BLUE_SENSOR_REAR_STATE_0_3V3
  Top 0.305: IC1.37 44.1,29.27 36.58,21.74 32.92,21.74 29.9,18.73 IC5.19
BLUE_SENSOR_REAR_STATE_1_3V3
  Top 0.305: IC1.38 44.6,28.96 36.78,21.13 33.12,21.13 30.55,18.56 IC5.18
BLUE_SENSOR_REAR_STATE_2_3V3
  Top 0.305: IC1.39 45.1,28.64 36.98,20.52 33.33,20.52 31.2,18.4 IC5.17
BLUE_SENSOR_REAR_STATE_3_3V3
  Top 0.305: IC1.40 45.6,28.33 37.19,19.91 33.53,19.91 31.85,18.24 IC5.16
BLUE_SENSOR_REAR_STATE_4_3V3
  Top 0.305: IC1.41 46.1,28.02 37.39,19.3 33.73,19.3 32.5,18.07 IC5.15
COLOR_SENSOR_FRONT_0  (via drill 0.6)
  Top 0.305: v26.82,47.14 28.25,47.14 29.17,46.22 IC1.5
  Bottom 0.305: R1.1 26.82,53.78 v26.82,47.14
  Bottom 0.406: 23.16,58.93 R5.2 | 23.16,58.93 23.57,58.52 23.57,57.44 R1.1 | C5.2 23.71,59.47 23.16,58.93
COLOR_SENSOR_FRONT_1  (via drill 0.6)
  Top 0.305: v27.84,45.72 IC1.6
  Bottom 0.305: R21.1 25.13,45.72 v27.84,45.72
  Bottom 0.406: R25.2 23.16,48.77 | 23.16,48.77 23.57,48.36 23.57,47.28 R21.1 | C13.2 23.71,49.31 23.16,48.77
COLOR_SENSOR_FRONT_2  (via drill 0.6)
  Top 0.305: IC1.7 28.96,45.22 28.25,44.5 26.21,44.5 v25.81,44.09
  Bottom 0.305: 23.98,40.78 23.98,41.45 | v25.81,44.09 23.71,42 C21.2
  Bottom 0.406: R57.2 23.16,39.01 | 23.16,39.01 23.98,39.83 23.98,40.78 C21.2 | 23.16,39.01 23.71,38.47 R53.1
COLOR_SENSOR_FRONT_3  (via drill 0.6)
  Top 0.305: IC1.8 29.48,44.72 28.04,43.28 v27.23,43.28
  Bottom 0.305: C7.2 24.76,32.75 27.23,35.22 v27.23,43.28
  Bottom 0.406: C7.2 23.71,30.21 23.16,29.67 | R13.2 23.16,29.67 | 23.16,29.67 23.71,29.12 R6.1
COLOR_SENSOR_FRONT_4  (via drill 0.6)
  Top 0.305: v28.45,42.06 30.6,44.22 IC1.9
  Bottom 0.305: C15.2 26.21,24.04 26.21,33.12 28.45,35.36 v28.45,42.06
  Bottom 0.406: C15.2 23.57,21.4 23.57,19.91 23.16,19.51 | R38.2 23.16,19.51 | 23.16,19.51 23.91,18.76 R29.1
COLOR_SENSOR_REAR_0  (via drill 0.6)
  Top 0.305: IC1.2 34.58,47.72 32.92,49.38 v32.92,50.49
  Bottom 0.305: C6.2 76,58.93 72.75,55.68 34.49,55.68 32.92,54.1 v32.92,50.49
  Bottom 0.406: R2.1 76.27,61.91 76.81,61.37 | 76.81,61.37 79.92,61.37 R7.2 | C6.2 76.06,60.62 76.81,61.37
COLOR_SENSOR_REAR_1  (via drill 0.6)
  Top 0.305: IC1.1 34.89,48.22 34.14,48.97 v34.14,49.68
  Bottom 0.305: R22.1 73.62,55.07 34.95,55.07 34.14,54.25 v34.14,49.68
  Bottom 0.406: R22.1 76,52.7 76,51.61 76.4,51.21 | 76.4,51.21 79.65,51.21 79.92,50.94 R26.2 | C14.2 75.86,50.66 76.4,51.21
COLOR_SENSOR_REAR_2  (via drill 0.6)
  Top 0.305: v35.36,53.03 35.36,51.41 36.55,50.22 IC1.100
  Bottom 0.305: R54.1 72.54,46.4 72.54,49.99 68.07,54.46 36.78,54.46 v35.36,53.03
  Bottom 0.406: R54.1 75.86,42 76.4,41.45 76.81,41.45 | 76.81,41.45 79.52,41.45 R58.2 | C22.2 75.86,40.5 76.81,41.45
COLOR_SENSOR_REAR_3  (via drill 0.6)
  Top 0.305: IC1.99 39.1,51.12 38.61,51.61 v36.78,51.61
  Bottom 0.305: v36.78,51.61 36.78,53.03 37.59,53.85 67.67,53.85 71.53,49.99 71.53,37.05 76.27,32.31
  Bottom 0.406: C8.2 76.27,30.75 76.81,31.29 | 76.81,31.29 79.92,31.29 R17.2 | R10.1 76.27,32.31 76.27,31.84 76.81,31.29
COLOR_SENSOR_REAR_4  (via drill 0.6)
  Top 0.305: v38.2,52.83 39.6,51.43 IC1.98
  Bottom 0.305: R32.1 76.27,26.35 73.97,28.65 73.97,33.33 70.71,36.58 70.71,49.58 67.26,53.03 38.41,53.03 v38.2,52.83
  Bottom 0.406: 76.81,21.54 76.27,22.08 R32.1 | C16.2 76.27,21 76.81,21.54 | 76.81,21.54 79.92,21.54 R42.2
GND  (via drill 0.6)
  Top 0.305: C41.2 69.9,21.68 69.9,23.37 69.32,23.95 IC4.8 69.29,24.69 69.29,25.81 68.28,26.82 63.45,26.82 61.7,28.57 | C38.2 C35.2 | 61.7,28.57 IC4.15 | 61.7,28.57 60.55,27.43 58.18,27.43 C38.2 | LED_K7.C LED_K6.C LED_K5.C LED_K4.C LED_K3.C LED_K2.C LED_K1.C LED_K0.C 67.68,8.09 v67.67,8.08 | 42.67,54.86 C32.1 | 42.67,54.86 C31.1 | IC3.1 58.15,67.77 C44.2 | IC1.33 42.1,36.82 v42.27,36.98 | IC1.43 47.1,36.33 v47.35,36.58 | IC1.23 39.45,37.22 v39.62,37.39 | IC1.13 39.06,42.22 v39.42,41.86 | IC1.3 39.15,47.22 v39.42,46.94 39.62,46.74 v43.89,46.74 42.1,48.52 IC1.93 42.1,51.37 41.45,52.02 40.23,52.02 38.61,53.65 37.03,53.65 34.34,56.34 34.34,60.25 34.85,60.76 41.25,60.76 42.67,59.33 42.67,54.86 | IC1.84 46.6,47.68 v47.35,46.94 | v62.38,13.82 60.12,13.82 UART_I2C.1 59.97,12.01 58.93,10.97 56.08,10.97 55.47,11.58 55.47,13.08 UART_I2C.5 54.86,13.69 54.86,16.61 51.66,19.81 | IC1.53 50.57,37.22 v49.99,37.8 49.99,36.88 52.27,34.59 v52.27,26.21 52.27,20.42 51.66,19.81 | IC1.63 49.33,42.22 v49.17,42.06 | IC1.73 50.67,47.22 v49.78,46.33 | v28.96,12.19 27.95,13.2 IC5.22 | 27.3,10.54 IC5.2 27.3,11.45 27.89,12.04 28.8,12.04 v28.96,12.19 | 16.02,10.69 IC2.2 16.02,11.45 16.46,11.89 17.22,11.89 v17.53,12.19 | v17.53,12.19 16.67,13.04 IC2.22 16.67,23.41 v15.7,24.38 15.7,34.14 v15.54,34.29 v15.54,43.89 v15.54,53.49 v15.54,63.4 | 21.87,10.89 IC2.11 IC2.12 22.52,11.61 21.95,12.19 | 37.77,10.64 IC6.2 37.77,11.1 38.56,11.89 39.01,11.89 v39.17,12.04 | 38.42,13.72 38.42,12.79 v39.17,12.04 | 38.42,13.72 IC6.22 | v39.17,12.04 39.32,11.89 | v39.17,12.04 41.15,12.04 41.67,12.56 | 41.67,12.56 IC6.17 IC6.16 IC6.15 IC6.14 IC6.13 46.38,16.66 49.53,19.81 51.66,19.81
  Top 0.305: IC6.12 IC6.11 43.62,11.86 42.92,12.56 41.67,12.56 | IC5.13 33.8,13.99 32,12.19 | 32,12.19 v28.96,12.19 | 32,12.19 33.15,11.04 IC5.11 IC5.12 36.8,13.72 38.42,13.72 | v8.08,73 v16.31,73 18.26,71.05 v22.86,71.05 | C38.2 56.17,27.37 v55.02,26.21 | v17.53,12.19 21.95,12.19 | IC2.13 22.52,12.77 21.95,12.19 | SENSOR_STATUS.1 SENSOR_STATUS.3 SENSOR_STATUS.5
  Top 0.406: LED_K7.C 85.67,8.09 86.87,9.3 v86.87,16.31 85.65,17.53 v85.65,26.36 85.65,35.05 v85.19,35.51 83.97,36.73 v83.97,46.02 83.82,46.18 v83.82,56.24 79.86,60.2 79.86,66.45 84.73,71.32 v85.95,71.32 v92.35,71.32 v98.3,71.32 | IC5.22 27.95,23.38 PDI_ATMEL.6
  Top 0.61: C43.2 54.52,75.63 v52.88,77.27 | v52.88,65.08 52.88,65.38 55.02,67.51 55.45,67.51 IC3.1 | ALIM.2 60.1,58.27 58.52,56.69 54.41,56.69 53.34,57.76 53.34,64.62 v52.88,65.08 | v52.88,65.08 50.75,62.94 34.44,62.94 32.61,61.11 32.61,53.03 36.42,49.23 37.34,49.23 38.25,48.31 39.01,48.31 39.42,47.9 v39.42,46.94
  Top 0.813: v1.83,68.58 6.25,73 v8.08,73
  Bottom 0.305: v42.27,36.98 42.27,34.94 C25.2 | C24.2 37.48,36.9 39.22,35.15 42.05,35.15 C25.2 | C25.2 47.24,34.88 C26.2 | v47.35,36.58 47.35,34.78 C26.2 | v39.62,37.39 37.93,37.39 C24.2 | C23.2 37.42,36.98 C24.2 | v39.42,41.86 37.48,41.86 C23.2 | C23.2 C19.2 39.22,46.74 v39.42,46.94 | 41.34,51.41 C20.2 41.54,51.21 43.08,51.21 43.89,50.39 | v43.89,46.74 43.89,50.39 | C30.2 46.11,48.99 44.7,50.39 43.89,50.39 | v47.35,46.94 47.35,48.88 C30.2 | C30.2 47.67,48.77 50.19,48.77 51.88,47.08 C29.2 51.22,46.33 v49.78,46.33 | C26.2 48.87,34.73 C27.2 51.22,37.8 | v62.38,13.82 62.28,13.72 C36.2 63.97,11.77 v67.67,8.08 | v49.99,37.8 51.22,37.8 | 51.22,37.8 51.73,38.3 C28.2 51.58,42.06 v49.17,42.06 | 17.51,12.18 v17.53,12.19 17.53,14.11 C33.2 | C45.2 39.25,12.13 v39.17,12.04 | R87.1 8.06,73.02 v8.08,73 | v16.31,73 13.02,73 R65.1 | T3.E 15.58,63.36 v15.54,63.4 | v15.54,53.49 15.54,51.12 T11.E | T21.E 15.58,43.86 v15.54,43.89 | 15.7,31.7 15.7,34.13 v15.54,34.29 14.63,35.2 9.14,35.2 8.53,34.59 C49.2 | 15.7,21.54 v15.7,24.38 14.63,25.45 7.77,25.45 6.55,24.23 C50.2 | v52.27,26.21 v55.02,26.21 | C40.2 28.96,10.07 v28.96,12.19 | C34.2 20,7.77 33.53,7.77 33.98,7.32 38.41,7.32 | 38.41,7.32 39.32,8.23 39.32,9.38 C46.2 | 38.41,7.32 38.41,6.96 39.22,6.15 SENSOR_STATUS.5 | R70.1 22.7,71.05 v22.86,71.05
  Bottom 0.406: T4.E 82.35,59.05 R14.1 82.23,57.83 v83.82,56.24 84.12,55.93 C53.2 | R89.1 83.31,71.54 T26.E 85.87,71.41 v85.95,71.32 | R66.1 89.81,71.54 T20.E 90.04,71.32 v92.35,71.32 | R71.1 96.72,71.68 T24.E | 82.11,48.48 R36.1 | 82.11,48.48 T12.E | R20.1 84.28,28.85 T8.E 84.39,27.62 v85.65,26.36 91.59,26.36 92.2,25.76 C55.2 | R64.1 83.7,39.01 T22.E 83.99,36.71 v85.19,35.51 85.65,35.97 C54.2 | R51.1 84.11,19.1 T16.E 84.58,18.63 84.58,17.37 85.65,16.31 v86.87,16.31 | T15.E 15.7,21.54 R49.1 | T7.E 15.7,31.7 R19.1 | T21.E 15.7,41.05 R63.1 | T11.E 17.46,51.09 R34.1 | R87.1 5.42,72.75 T25.E | R65.1 13.14,72.88 T19.E | R70.1 20.73,70.58 T23.E 20.86,70.37 21.54,69.7 21.54,67.06 17.74,63.26 R12.1 17.62,60.84 T3.E | C39.2 28.94,12.21 v28.96,12.19 28.94,12.18 | C34.2 17.53,10.28 v17.53,12.19 | C46.2 39.17,9.54 v39.17,12.04 | 82.11,48.48 82.11,47.89 v83.97,46.02 84.28,45.72 C52.2 | T24.E 98.21,71.41 v98.3,71.32 | C47.2 8.08,44.2 8.84,44.96 14.48,44.96 v15.54,43.89 | C48.2 8.23,54.1 9.3,55.17 13.87,55.17 v15.54,53.49 | T24.E 96.93,70.94 96.93,67.67 96.47,67.21 96.47,66.6 95.71,65.84 95.71,64.5 C56.2
  Bottom 0.61: v52.88,65.08 v52.88,77.27
  Bottom 0.813: v1.83,68.58 4.3,66.11 C51.2
  other vias: 39,73 64.05,74.05 72,61 65,48 4.85,3.49 94,6 73,4
  pour Bottom: 0,0 0,80 100,80 100,0
  pour Top: 0,0 0,80 100,80 100,0
GREEN_LED_ON_FRONT_3V3  (via drill 0.6)
  Top 0.305: IC1.16 26.75,40.72 23.98,43.48 23.98,53.65 28.45,58.12 v28.45,64.82
  Bottom 0.406: R61.1 R65.2 14.7,76.61 22.35,76.61 22.99,75.97 22.99,74.97 24.79,73.17 24.79,71.21 28.45,67.56 v28.45,64.82
GREEN_LED_ON_FRONT_PW  (via drill 0.6)
  Top 0.813: v9.75,24.33 v9.75,33.93 v9.75,43.89 v9.75,53.85 v9.75,65.43
  Bottom 0.406: LED6.2 8.65,20 8.33,20.32 8.33,22.71 9.75,24.13 v9.75,24.33 | LED9.2 8.61,30 8.33,30.28 8.33,32.51 v9.75,33.93 | LED5.2 8.56,40 8.33,40.23 8.33,42.47 v9.75,43.89 | LED2.2 8.72,50 8.33,50.39 8.33,52.43 v9.75,53.85 | LED1.2 8.68,60 8.33,60.35 8.33,64.01 v9.75,65.43
  Bottom 0.813: T19.C 9.75,66.21 v9.75,65.43
GREEN_LED_ON_REAR_3V3  (via drill 0.6)
  Top 0.305: v85.5,75.74 84.43,74.68 77.72,74.68 66.14,63.09 66.14,57.61 61.87,53.34 47.55,53.34 45.6,51.39 IC1.86
  Bottom 0.305: v85.5,75.74 87.77,75.74 R62.1
  Bottom 0.406: R62.1 R66.2
GREEN_LED_ON_REAR_PW  (via drill 0.6)
  Top 0.813: v90.22,24.08 v90.22,33.98 v90.22,44.04 v90.22,53.65 v90.22,64.47
  Bottom 0.406: v90.22,64.47 91.75,62.94 91.75,60.2 91.55,60 LED7.2 | LED4.2 91.44,49.99 91.75,50.29 91.75,52.12 v90.22,53.65 | LED3.2 91.36,40 91.75,40.39 91.75,42.52 v90.22,44.04 | LED10.2 91.32,20 91.75,20.42 91.75,22.55 v90.22,24.08 | LED8.2 91.27,30 91.75,30.48 91.75,32.46 v90.22,33.98
  Bottom 0.813: T20.C 89,65.68 v90.22,64.47
N$1
  Top 0.305: IC4.1 60.43,21.96 C37.1
N$2
  Bottom 0.406: LED1.5 4.35,60 R8.2
N$3
  Bottom 0.406: LED2.5 4.21,50 R28.2
N$4
  Bottom 0.406: R55.2 6.5,41.86 6.81,41.55 LED5.6
N$5
  Top 0.305: IC4.3 62.97,22.6 C37.2
N$6
  Top 0.305: IC4.4 64.24,21.7 C42.1
N$7
  Bottom 0.406: R34.2 C13.1
N$8
  Bottom 0.406: LED1.6 6.91,61 6.91,61.37 6.1,62.18 R3.2
N$9
  Bottom 0.406: T9.E 13.67,51.1 T11.B
N$10
  Bottom 0.406: C9.1 21.81,46.74 R21.2
N$11
  Top 0.305: C38.1 58.99,25.47 59.94,26.42 61.16,26.42 61.57,26.01 61.57,24.79 IC4.2
N$12
  Bottom 0.406: R63.2 C21.1
N$13
  Top 0.305: IC4.6 66.78,22.9 C41.1
N$14
  Bottom 0.406: LED5.5 4.2,40 R59.2
N$15
  Bottom 0.406: R23.2 6.1,52.02 6.81,51.31 LED2.6
N$16
  Bottom 0.406: T17.E 12.17,40.93 T21.B
N$17
  Bottom 0.406: C17.1 R53.2
N$18
  Bottom 0.406: R12.2 C5.1
N$19
  Bottom 0.406: R5.1 14.92,58.93 T3.C
N$20
  Bottom 0.406: R19.2 C7.1
N$21
  Bottom 0.406: 12.07,31.17 T5.E 13.2,31.1 T7.B
N$22
  Bottom 0.406: R6.2 21.4,27.64 C3.1
N$23
  Bottom 0.406: T1.E 13.42,61.1 T3.B
N$24
  Top 0.305: IC4.5 65.51,22.01 C42.2
N$25
  Bottom 0.406: C1.1 R1.2
N$26
  Bottom 0.406: R49.2 C15.1
N$27
  Bottom 0.406: LED9.5 4.28,30 R16.2
N$28
  Bottom 0.406: LED9.6 6.81,31.8 6.5,32.11 R11.2
N$29
  Bottom 0.406: T15.B 13.36,21.1 T13.E
N$30
  Bottom 0.406: C11.1 R29.2
N$31
  Bottom 0.406: T11.C 17.62,48.89 R25.1
N$32
  Bottom 0.406: C6.1 R14.2
N$33
  Bottom 0.406: T4.B 86.44,58.9 T2.E
N$34
  Bottom 0.406: R2.2 C2.1
N$35
  Bottom 0.406: LED6.5 4.29,20 R41.2
N$36
  Bottom 0.406: LED6.6 6.81,21.64 6.5,21.95 R35.2
N$37
  Bottom 0.406: T21.C 14.92,39.01 R57.1
N$38
  Bottom 0.406: C14.1 R36.2
N$39
  Bottom 0.406: T10.E 87.6,48.48 T12.B
N$40
  Bottom 0.406: R22.2 C10.1
N$41
  Bottom 0.406: T7.C 14.92,29.67 R13.1
N$42
  Bottom 0.406: C22.1 R64.2
N$43
  Bottom 0.406: R60.2 95.54,40 LED3.5
N$44
  Bottom 0.406: R56.2 94.69,38.2 93.88,39.01 93.28,39.01 LED3.6
N$45
  Top 0.305: IC1.91 43.1,52.25 44.69,53.83 C31.2 44.69,54.9 46.18,56.39 46.18,58.67 46.63,59.13 47.9,59.13 Q1.2
N$46
  Top 0.305: IC1.92 42.6,51.89 41.86,52.63 40.49,52.63 38.57,54.54 C32.2 38.3,55.13 Q1.1
N$47
  Bottom 0.406: T22.B 87.83,38.73 T18.E
N$48
  Bottom 0.406: R54.2 C18.1
N$49
  Bottom 0.406: T15.C 15.97,19.22 16.26,19.51 R38.1
N$50
  Bottom 0.406: C8.1 R20.2
N$51
  Bottom 0.406: T8.B 87.93,28.97 T6.E
N$52
  Bottom 0.406: R10.2 C4.1
N$53
  Bottom 0.406: LED4.5 R30.2
N$54
  Bottom 0.406: R24.2 93.88,47.95 93.19,48.64 LED4.6
N$55
  Bottom 0.406: R76.1 6.5,58.12 6.81,58.42 LED1.4
N$56
  Bottom 0.406: C16.1 R51.2
N$57
  Bottom 0.406: T14.E 86.38,18.9 T16.B
N$58
  Bottom 0.406: R32.2 C12.1
N$59
  Top 0.305: IC1.55 67.86,38.22 73.76,32.31 73.76,19.71 70.31,16.26 R33.1
N$60
  Top 0.305: IC1.56 68.17,38.72 74.57,32.31 74.57,19.1 72.34,16.87 R37.1
N$61
  Bottom 0.406: R9.2 95.63,60 LED7.5
N$62
  Bottom 0.406: R4.2 93.47,58.12 93.19,58.4 LED7.6
N$63
  Top 0.305: IC1.57 68.48,39.22 75.59,32.11 75.59,18.09 74.37,16.87 R40.1
N$64
  Bottom 0.406: R77.1 6.1,37.8 6.81,38.51 LED5.4
N$65
  Bottom 0.406: LED2.4 6.81,48.26 6.5,47.95 R78.1
N$66
  Bottom 0.406: LED6.4 6.81,18.59 6.1,17.88 R79.1
N$67
  Bottom 0.406: LED9.4 6.81,28.35 6.5,28.04 R80.1
N$68
  Bottom 0.406: T4.C 85.06,60.96 R7.1
N$69
  Bottom 0.406: R45.2 95.69,20 LED10.5
N$70
  Bottom 0.406: R15.2 93.88,28.04 93.19,28.73 LED8.6
N$71
  Bottom 0.406: R26.1 81.94,50.68 T12.C
N$72
  Bottom 0.406: T22.C 81.94,40.93 R58.1
N$73
  Bottom 0.406: R69.2 94.69,71.54 T24.B
N$74
  Bottom 0.406: T23.B 18.69,70.71 R68.2
N$75
  Bottom 0.406: T19.B 10.97,71.12 R61.2
N$76
  Bottom 0.406: R62.2 87.78,71.68 T20.B
N$77
  Bottom 0.406: LED8.5 95.7,30 R18.2
N$78
  Bottom 0.406: R39.2 93.88,17.88 93.19,18.57 LED10.6
N$79
  Bottom 0.406: T16.C 82.35,21.01 R42.1
N$80
  Bottom 0.406: T8.C 82.52,31.17 R17.1
N$81
  Bottom 0.406: R82.1 93.88,52.02 93.19,51.33 LED4.4
N$82
  Bottom 0.406: R83.1 93.88,21.95 93.19,21.26 LED10.4
N$83
  Bottom 0.406: R84.1 93.88,62.18 93.19,61.49 LED7.4
N$84
  Bottom 0.406: R85.1 93.88,32.11 93.19,31.42 LED8.4
N$85
  Bottom 0.406: R81.1 93.88,42.27 93.19,41.58 LED3.4
N$86
  Bottom 0.406: R86.2 3.52,72.88 T25.B
N$87
  Top 0.305: IC1.58 68.79,39.72 76.4,32.11 R44.1
N$88
  Top 0.305: IC1.59 69.11,40.22 78.44,30.89 R47.1
N$89
  Top 0.305: IC1.60 69.42,40.72 80.47,29.67 R48.1
N$90
  Top 0.305: IC1.61 69.73,41.22 82.5,28.45 R50.1
N$91
  Top 0.305: LED_K0.A R33.2
N$92
  Top 0.305: LED_K1.A R37.2
N$93
  Top 0.305: LED_K2.A R40.2
N$94
  Top 0.305: LED_K3.A R44.2
N$95
  Bottom 0.406: R88.2 81.28,71.68 T26.B
N$96
  Top 0.305: IC1.62 70.05,41.72 84.53,27.23 R52.1
N$100
  Top 0.305: LED_K4.A R47.2
N$101
  Top 0.305: LED_K5.A R48.2
N$102
  Top 0.305: LED_K6.A R50.2
N$103
  Top 0.305: LED_K7.A R52.2
N$113  (via drill 0.6)
  Top 0.305: IC2.1 13.77,10.72 v12.35,9.3
  Bottom 0.305: C34.1 15.54,10.19 | C34.1 15.7,10.35 15.7,11.43 14.16,12.96 SW1.1 | C34.1 14.65,9.3 v12.35,9.3
N$130  (via drill 0.6)
  Top 0.305: IC5.1 26.65,12.48 v26.98,12.8
  Bottom 0.305: C40.1 26.91,10.19 | C40.1 26.98,9.99 v26.98,12.8 | C40.1 26.98,10.12 | SW2.1 25.81,11.29 C40.1
N$131  (via drill 0.6)
  Top 0.305: v37.34,12.34 37.12,12.12 IC6.1
  Bottom 0.305: v37.34,12.34 37.34,9.54 C46.1 36.88,9.92 36.88,11.12 36.11,11.9 SW3.1
PDI_DATA_3V3  (via drill 0.6)
  Top 0.305: IC1.89 44.1,51.42 47.24,54.56 50.44,54.56 v52.43,56.54
  Bottom 0.305: PDI_ATMEL.1 35,30.53 31.85,33.68 31.85,45.57 30.48,46.94 30.48,54.56 32.46,56.54 v52.43,56.54
RED_LED_ON_FRONT_3V3  (via drill 0.6)
  Top 0.305: IC1.15 27.26,41.22 24.79,43.69 24.79,53.24 29.87,58.32 v29.87,66.66
  Bottom 0.406: R86.1 R87.2 8.19,77.42 22.76,77.42 23.74,76.44 23.74,75.27 25.54,73.47 25.54,71.51 29.87,67.19 v29.87,66.66
RED_LED_ON_FRONT_PW  (via drill 0.6)
  Top 0.813: v7.32,65.43 v7.32,56.9 v7.32,47.35 v7.32,37.19 v7.32,27.23 7.32,16.92 v7.37,16.87
  Bottom 0.406: LED9.3 9.19,29.1 v7.32,27.23 | LED5.3 9.23,39.1 v7.32,37.19 | LED2.3 9.07,49.1 v7.32,47.35 | LED1.3 9.52,59.1 v7.32,56.9 | LED6.3 9.35,19.1 7.37,17.12 v7.37,16.87
  Bottom 0.813: T25.C 4.47,68.28 v7.32,65.43
RED_LED_ON_REAR_3V3  (via drill 0.6)
  Top 0.305: v77.57,75.74 65.53,63.7 65.53,58.06 61.42,53.95 47.4,53.95 45.1,51.66 IC1.87
  Bottom 0.305: v77.57,75.74 81.27,75.74 R88.1
  Bottom 0.406: R88.1 R89.2
RED_LED_ON_REAR_PW  (via drill 0.6)
  Top 0.813: v87.33,64.31 88.54,63.09 v88.54,53.19 | v88.54,23.47 v88.54,33.53 v88.54,43.74 v88.54,53.19 | v88.54,53.19 88.54,54.1
  Bottom 0.406: v88.54,23.47 90.24,21.77 LED10.3 | LED8.3 90.24,31.83 v88.54,33.53 | LED3.3 90.24,42.04 v88.54,43.74 | LED4.3 90.24,51.49 v88.54,53.19 | LED7.3 90.24,61.4 v87.33,64.31
  Bottom 0.813: T26.C 82.5,69.14 v87.33,64.31
RX_3V3  (via drill 0.6)
  Top 0.305: IC4.12 65.63,30.94 65.63,32.31 65.97,32.65 R73.2 66.04,33.65 v66.04,35.36 65.89,35.51 55.02,35.51 54.31,36.22 IC1.51
  Bottom 0.305: R43.2 65.28,34.59 v66.04,35.36
RX_232
  Top 0.305: IC4.13 64.07,30.97 R73.1 63.82,33.33 56.69,33.33 53.65,30.28 53.65,24.18 57.43,20.4 UART_I2C.3
SCL_3V3  (via drill 0.6)
  Top 0.305: UART_I2C.6 53.62,4.5 54.86,3.25 v56.9,3.25 | IC1.46 48.6,31.41 48.92,31.09 48.92,27.58 v48.16,26.82
  Bottom 0.305: 57.1,15.04 57.1,9.72 R31.1 56.9,9.52 v56.9,3.25 | 57.1,15.04 57.1,15.65 | v48.16,26.82 57.1,17.88 57.1,15.04
SDA_3V3  (via drill 0.6)
  Top 0.305: 52.02,13.99 UART_I2C.7 52.35,15.11 v49.58,17.88 | IC1.45 48.1,31.15 48.46,30.79 48.46,28.35 46.94,26.82 v46.94,24.99
  Bottom 0.305: v46.94,24.99 46.94,20.52 v49.58,17.88 50.6,16.87 50.6,14.63 52.02,13.21 R27.1
TX_3V3  (via drill 0.6)
  Top 0.305: IC4.11 66.78,29.34 67.26,28.85 71.56,28.85 R74.2 | IC4.11 66.78,32.23 67.87,33.33 v67.87,34.75 66.34,36.27 55.17,36.27 54.73,36.72 IC1.52 | IC4.11 IC4.10
  Bottom 0.305: R46.1 67.61,34.49 v67.87,34.75
TX_232
  Top 0.305: UART_I2C.2 59.89,8.08 71.68,19.86 R74.1 70.5,26.84 69.49,27.84 64.62,27.84 62.97,29.49 IC4.14
YELLOW_FRONT_0_5V
  Top 0.305: IC2.8 19.92,7.12 20.43,6.61 20.43,4.83 SENSOR_STATUS.22
YELLOW_FRONT_1_5V
  Top 0.305: IC2.9 20.57,7.33 SENSOR_STATUS.19
YELLOW_FRONT_2_5V
  Top 0.305: IC2.10 21.22,8.56 22.99,6.8 22.99,4.84 SENSOR_STATUS.20
YELLOW_FRONT_3_5V
  Top 0.305: IC5.3 27.95,9.17 27.34,8.56 25.69,8.56 24.29,7.17 SENSOR_STATUS.17
YELLOW_FRONT_4_5V
  Top 0.305: IC5.4 28.6,8.92 27.49,7.81 26.44,7.81 25.54,6.91 25.54,4.86 SENSOR_STATUS.18
YELLOW_REAR_0_5V
  Top 0.305: IC5.10 32.5,7.46 33.2,6.76 33.2,4.9 SENSOR_STATUS.12
YELLOW_REAR_1_5V
  Top 0.305: IC6.3 38.42,10.22 34.45,6.26 SENSOR_STATUS.9
YELLOW_REAR_2_5V
  Top 0.305: IC6.4 39.07,10.11 35.76,6.8 35.76,4.91 SENSOR_STATUS.10
YELLOW_REAR_3_5V
  Top 0.305: IC6.5 39.72,10 36.99,7.27 SENSOR_STATUS.7
YELLOW_REAR_4_5V
  Top 0.305: IC6.6 40.37,9.89 38.31,7.83 38.31,4.93 SENSOR_STATUS.8
YELLOW_SENSOR_FRONT_STATE_0_3V3
  Top 0.305: IC1.30 40.6,32.07 39.01,30.48 25.6,30.48 20.57,25.45 IC2.16
YELLOW_SENSOR_FRONT_STATE_1_3V3
  Top 0.305: IC1.31 41.1,31.75 39.22,29.87 25.81,29.87 21.22,25.29 IC2.15
YELLOW_SENSOR_FRONT_STATE_2_3V3
  Top 0.305: IC1.32 41.6,31.44 39.42,29.26 26.01,29.26 21.87,25.12 IC2.14
YELLOW_SENSOR_FRONT_STATE_3_3V3
  Top 0.305: IC1.35 43.1,29.89 36.17,22.96 32.51,22.96 28.6,19.05 IC5.21
YELLOW_SENSOR_FRONT_STATE_4_3V3
  Top 0.305: IC1.36 43.6,29.58 36.37,22.35 32.72,22.35 29.25,18.89 IC5.20
YELLOW_SENSOR_REAR_STATE_0_3V3
  Top 0.305: IC1.42 46.6,27.7 37.59,18.69 33.93,18.69 33.15,17.91 IC5.14
YELLOW_SENSOR_REAR_STATE_1_3V3
  Top 0.305: IC1.47 49.1,31.67 49.38,31.39 49.38,23.01 48.77,22.4 44.04,22.4 39.07,17.43 IC6.21
YELLOW_SENSOR_REAR_STATE_2_3V3
  Top 0.305: IC1.48 49.6,32.08 49.99,31.7 49.99,22.71 49.07,21.79 44.2,21.79 39.72,17.31 IC6.20
YELLOW_SENSOR_REAR_STATE_3_3V3
  Top 0.305: IC1.49 50.1,32.5 50.6,32 50.6,22.55 50.29,22.25 49.23,21.18 44.35,21.18 40.37,17.2 IC6.19
YELLOW_SENSOR_REAR_STATE_4_3V3
  Top 0.305: IC1.50 50.6,32.91 51.21,32.31 51.21,22.25 49.53,20.57 44.5,20.57 41.02,17.09 IC6.18